# EAGLE design Modemplatine_modem_1_1 (EAGLE 6.1)
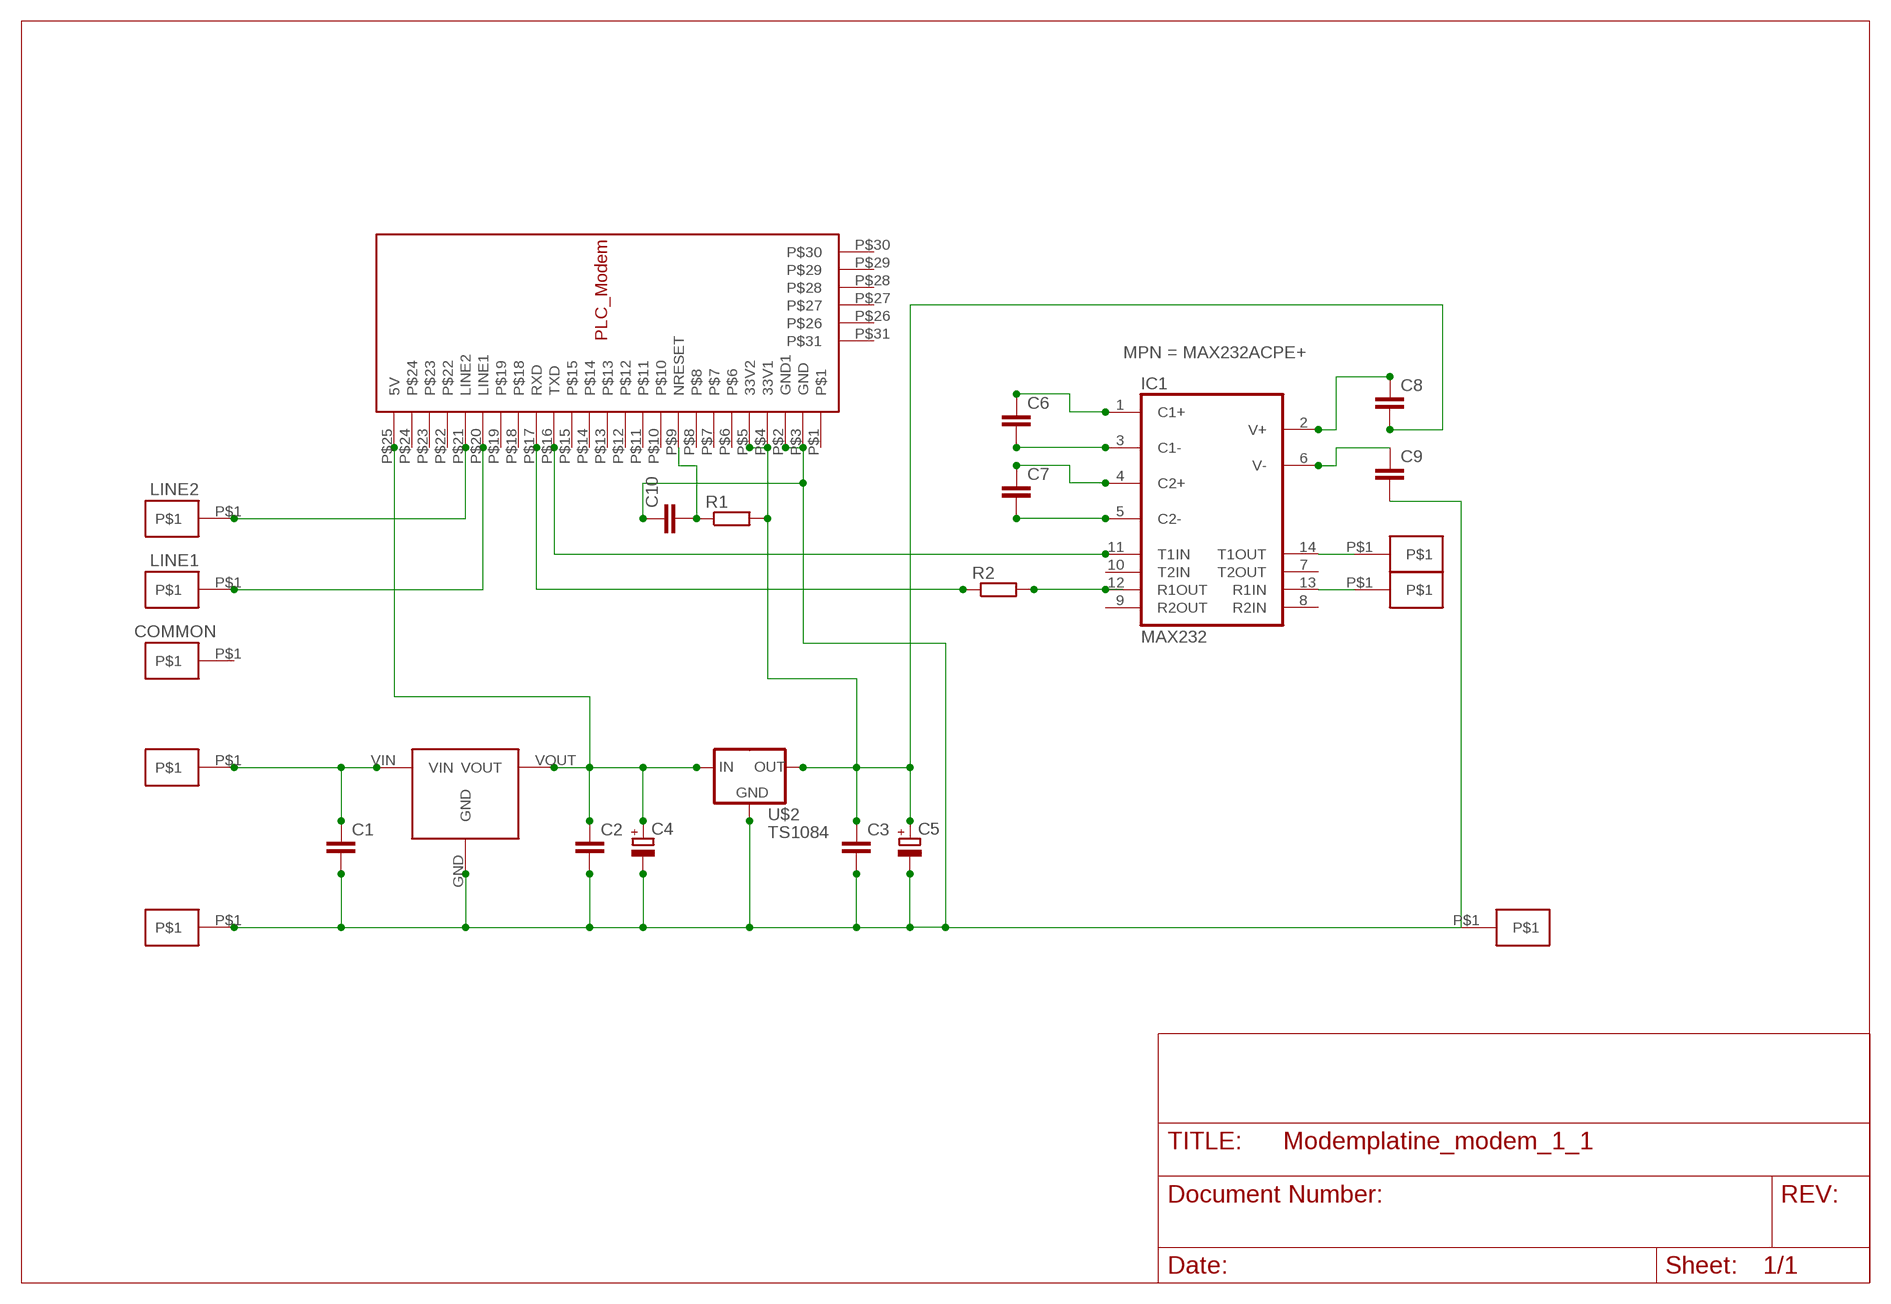
[diagram p0: schematic, sheet 1]

## Parts
C1  C2.5/5  [C2.5-5]
C2  C2.5/5  [C2.5-5]
C3  C2.5/5  [C2.5-5]
C4  CPOL-EUE2.5-5  [E2,5-5]
C5  CPOL-EUE2.5-5  [E2,5-5]
C6  C-EU025-040X050  [C025-040X050]
C7  C-EU025-040X050  [C025-040X050]
C8  C-EU025-040X050  [C025-040X050]
C9  C-EU025-040X050  [C025-040X050]
C10  C-EU025-040X050  [C025-040X050]
IC1  MAX232  [DIL16]
LINE1  PN4  [PIN2]
LINE2  PN4  [PIN2]
R1  R-EU_0207/10  [0207/10]
R2  R-EU_0207/10  [0207/10]
U$1  RECOM_785_05  [RECOM785X]
U$2  TS1084  [TS1084]
U$3  MODEMSTECKER  [MODEM_FUSS]
U$4  PN4  [PIN2]
U$5  PN4  [PIN2]
U$6  PN4  [PIN2]
U$7  PN4  [PIN2]
U$8  PN4  [PIN2]
U$11  PN4  [PIN2]

## Nets
N$1: C1.1 U$1.VIN U$5.P$1
N$2: C1.2 C2.2 C3.2 C4.- C5.- C9.2 C10.1 U$1.GND U$2.1GND(GND) U$3.P$2(GND1) U$3.P$3(GND) U$4.P$1 U$8.P$1
N$3: C2.1 C4.+ U$1.VOUT U$2.3IN(IN) U$3.P$25(5V)
N$4: C3.1 C5.+ C8.2 R1.2 U$2.2OUT(OUT) U$3.P$4(33V1) U$3.P$5(33V2)
N$5: LINE2.P$1 U$3.P$21(LINE2)
N$6: LINE1.P$1 U$3.P$20(LINE1)
N$7: C6.1 IC1.1(C1+)
N$8: C6.2 IC1.3(C1-)
N$9: C7.1 IC1.4(C2+)
N$10: C7.2 IC1.5(C2-)
N$11: C8.1 IC1.2(V+)
N$12: C9.1 IC1.6(V-)
N$14: IC1.14(T1OUT) U$6.P$1
N$15: IC1.13(R1IN) U$7.P$1
N$16: IC1.11(T1IN) U$3.P$16(TXD)
N$17: IC1.12(R1OUT) R2.2
N$18: R2.1 U$3.P$17(RXD)
N$19: C10.2 R1.1 U$3.P$9(NRESET)
Unconnected: IC1.7(T2OUT) IC1.8(R2IN) IC1.9(R2OUT) IC1.10(T2IN) U$3.P$1 U$3.P$6 U$3.P$7 U$3.P$8 U$3.P$10 U$3.P$11 U$3.P$12 U$3.P$13 U$3.P$14 U$3.P$15 U$3.P$18 U$3.P$19 U$3.P$22 U$3.P$23 U$3.P$24 U$3.P$26 U$3.P$27 U$3.P$28 U$3.P$29 U$3.P$30 U$3.P$31 U$11.P$1

## Power pins joined to a net without a drawn wire
GND: IC1.15(GND)
VCC: IC1.16(VCC)

## Library data of the parts
C1-C3 = capacitor-wima:C: CAPACITOR naming: grid - package width
C4 C5 = resistor:CPOL-EU: POLARIZED CAPACITOR, European symbol
C6-C10 = resistor:C-EU: CAPACITOR, European symbol
IC1 = maxim:MAX232: RS232 TRANSEIVER; MF: MAXIM; MPN: MAX232ACPE+; OC_FARNELL: 9723773; OC_NEWARK: 68K4544
LINE1 LINE2 U$4-U$8 U$11 = Strommessung:PN4
R1 R2 = resistor:R-EU_: RESISTOR, European symbol
U$1 = ADS:RECOM_785_05
U$2 = ADS1:TS1084
U$3 = ADS:MODEMSTECKER

## Board
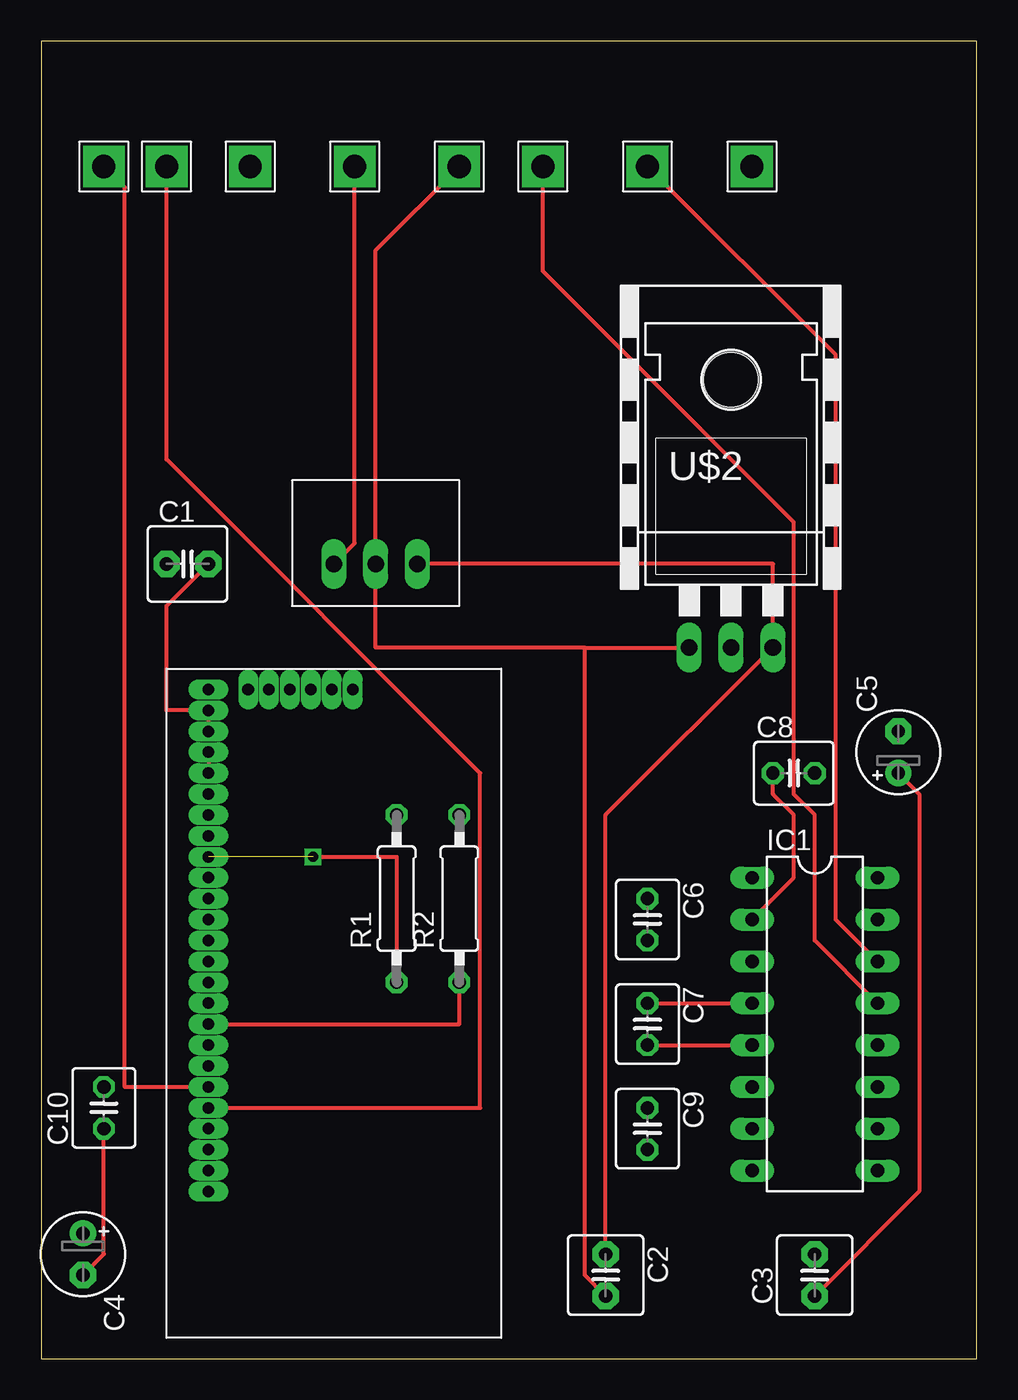
[diagram p1: board, top side]
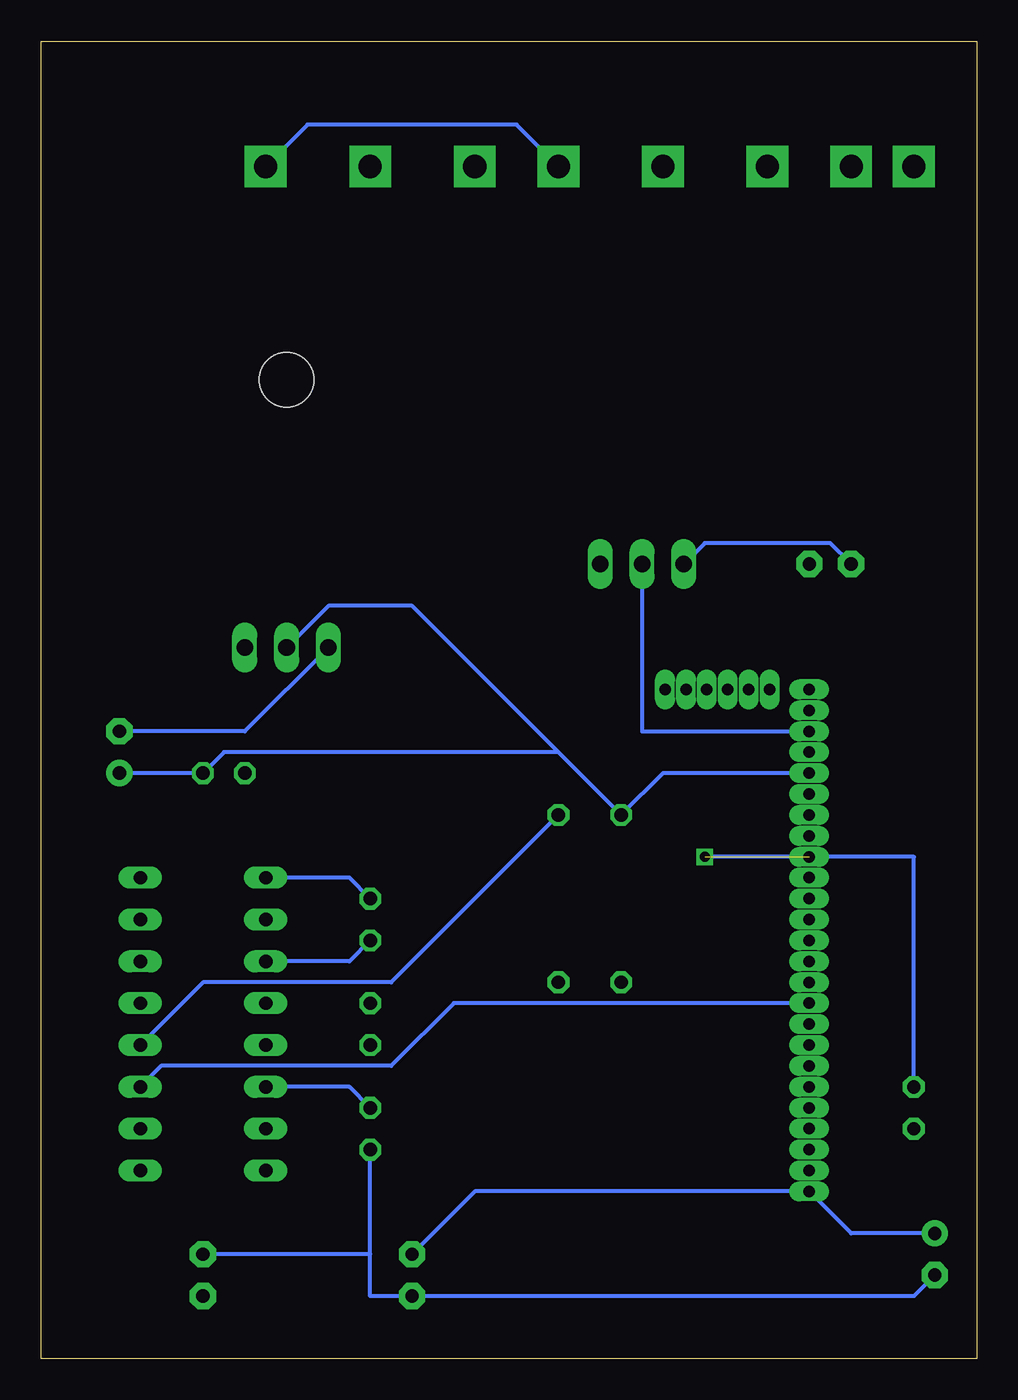
[diagram p2: board, bottom side, seen from below]

Size 56.82 x 80 mm. Coordinates in mm from the lower left corner, seen from the top.
Outline: 0,0 56.82,0 56.82,80 0,80 0,0
Copper layers (1*16): Top 0.035mm / dielectric 1.5mm / Bottom 0.035mm
Design rules: minimum track width 10mil, minimum drill 24mil, track to track 8mil, track to pad 8mil, pad to pad 8mil, via to via 8mil, smd to smd 8mil, copper to edge 40mil, drill to drill 8mil, minimum pad ring 10mil, minimum via ring 8mil, stop-mask expansion 4mil, vias tented up to drill 0mil, thermal gap 10mil

### Footprints (pad centres in the part's own frame; a part is rotated, then mirrored left to right if it is on the bottom)
C2.5-5 = drill 0.813 pad 1.6 octagon: 1 -1.27,0; 2 1.27,0
E2,5-5 = drill 0.813 pad 1.6: + -1.27,0 | drill 0.813 pad 1.6 octagon: - 1.27,0
C025-040X050 = drill 0.813 octagon: 1 -1.27,0; 2 1.27,0
DIL16 = drill 0.813 long: 1 -8.89,-3.81; 2 -6.35,-3.81; 3 -3.81,-3.81; 4 -1.27,-3.81; 5 1.27,-3.81; 6 3.81,-3.81; 7 6.35,-3.81; 8 8.89,-3.81; 9 8.89,3.81; 10 6.35,3.81; 11 3.81,3.81; 12 1.27,3.81; 13 -1.27,3.81; 14 -3.81,3.81; 15 -6.35,3.81; 16 -8.89,3.81
PIN2 = drill 1.4 pad 2.54 square: P$1 0,0
0207/10 = drill 0.813 octagon: 1 -5.08,0; 2 5.08,0
RECOM785X = drill 1 long: GND 0,2.54; VIN -2.54,2.54; VOUT 2.54,2.54
TS1084 = drill 1.016 long: 1GND 5.08,1.27; 2OUT 7.62,1.27; 3IN 10.16,1.27 | hole 3.302: 7.62,17.526
MODEM_FUSS = drill 0.7 pad 0.813 long: P$1 -20.32,-8.89; P$2 -19.05,-8.89; P$3 -17.78,-8.89; P$4 -16.51,-8.89; P$5 -15.24,-8.89; P$6 -13.97,-8.89; P$7 -12.7,-8.89; P$8 -11.43,-8.89; P$9 -10.16,-8.89; P$10 -8.89,-8.89; P$11 -7.62,-8.89; P$12 -6.35,-8.89; P$13 -5.08,-8.89; P$14 -3.81,-8.89; P$15 -2.54,-8.89; P$16 -1.27,-8.89; P$17 0,-8.89; P$18 1.27,-8.89; P$19 2.54,-8.89; P$20 3.81,-8.89; P$21 5.08,-8.89; P$22 6.35,-8.89; P$23 7.62,-8.89; P$24 8.89,-8.89; P$25 10.16,-8.89; P$29 -20.32,-3.937; P$30 -20.32,-5.207; P$31 -20.32,-6.477 | drill 0.7 pad 0.61 long: P$26 -20.32,-0.127; P$27 -20.32,-1.397; P$28 -20.32,-2.667

### Placement (x,y rotation side)
C1  8.89,48.26 0 top
C2  34.29,5.08 270 top
C3  46.99,5.08 90 top
C4  2.54,6.35 270 top
C5  52.07,36.83 90 top
C6  36.83,26.67 270 top
C7  36.83,20.32 270 top
C8  45.72,35.56 0 top
C9  36.83,13.97 270 top
C10  3.81,15.24 90 top
IC1  46.99,20.32 270 top
LINE1  3.81,72.39 0 top
LINE2  7.62,72.39 0 top
R1  21.59,27.94 90 top
R2  25.4,27.94 90 top
U$1  20.32,45.72 0 top
U$2  34.29,41.91 0 top
U$3  19.05,20.32 270 top
U$4  25.4,72.39 0 top
U$5  19.05,72.39 0 top
U$6  36.83,72.39 0 top
U$7  30.48,72.39 0 top
U$8  43.18,72.39 0 top
U$11  12.7,72.39 0 top

### Tracks (layer width: path | path; a pad name or v marks a point on that pad's centre or on a via)
N$1
  Top 0.254: U$1.VIN 19.05,49.53 U$5.P$1
  Bottom 0.254: C1.1 8.89,49.53 16.51,49.53 U$1.VIN
N$2
  Top 0.254: C10.1 3.81,6.35 C4.- | U$3.P$3 U$3.P$2 7.62,39.37 7.62,45.72 C1.2 | U$4.P$1 20.32,67.31 U$1.GND 20.32,43.18 33.02,43.18 | 33.02,43.18 U$2.1GND | C2.2 33.02,5.08 33.02,43.18
  Bottom 0.254: 36.83,6.35 36.83,3.81 C2.2 3.81,3.81 C4.- | 36.83,6.35 C9.2 | 36.83,6.35 C3.2 | U$2.1GND 44.45,38.1 C5.- | U$1.GND 20.32,38.1 U$3.P$3 | U$8.P$1 40.64,74.93 27.94,74.93 U$4.P$1
N$3
  Top 0.254: U$1.VOUT 44.45,48.26 U$2.3IN 34.29,33.02 C2.1
  Bottom 0.254: C4.+ 7.62,7.62 U$3.P$25 30.48,10.16 C2.1
N$4
  Top 0.254: C3.1 53.34,10.16 53.34,34.29 C5.+ | U$3.P$4 U$3.P$5
  Bottom 0.254: C5.+ C8.2 45.72,36.83 25.4,36.83 | U$3.P$5 19.05,35.56 R1.2 25.4,36.83 | U$2.2OUT 39.37,45.72 34.29,45.72 25.4,36.83
N$5
  Top 0.254: U$3.P$21 26.67,15.24 26.67,35.56 7.62,54.61 LINE2.P$1
N$6
  Top 0.254: U$3.P$20 5.08,16.51 5.08,71.12 LINE1.P$1
N$7
  Bottom 0.254: C6.1 38.1,29.21 IC1.1
N$8
  Bottom 0.254: C6.2 38.1,24.13 IC1.3
N$9
  Top 0.254: C7.1 IC1.4
N$10
  Top 0.254: C7.2 IC1.5
N$11
  Top 0.254: IC1.2 45.72,29.21 45.72,33.02 44.45,34.29 C8.1
N$12
  Bottom 0.254: C9.1 38.1,16.51 IC1.6
N$14
  Top 0.254: IC1.14 48.26,26.67 48.26,60.96 U$6.P$1
N$15
  Top 0.254: IC1.13 46.99,25.4 46.99,33.02 45.72,34.29 45.72,50.8 30.48,66.04 U$7.P$1
N$16
  Bottom 0.254: U$3.P$16 31.75,21.59 35.56,17.78 49.53,17.78 IC1.11
N$17
  Bottom 0.254: R2.2 35.56,22.86 46.99,22.86 IC1.12
N$18
  Top 0.254: U$3.P$17 25.4,20.32 R2.1
N$19  (via drill 0.6)  (1 unrouted)
  Top 0.254: R1.1 21.59,30.48 v16.51,30.48
  Bottom 0.254: C10.2 3.81,30.48 v16.51,30.48